# EasyEDA Pro project ProPrj_Microros_esp32_2025-06-17.epro, board PCB1
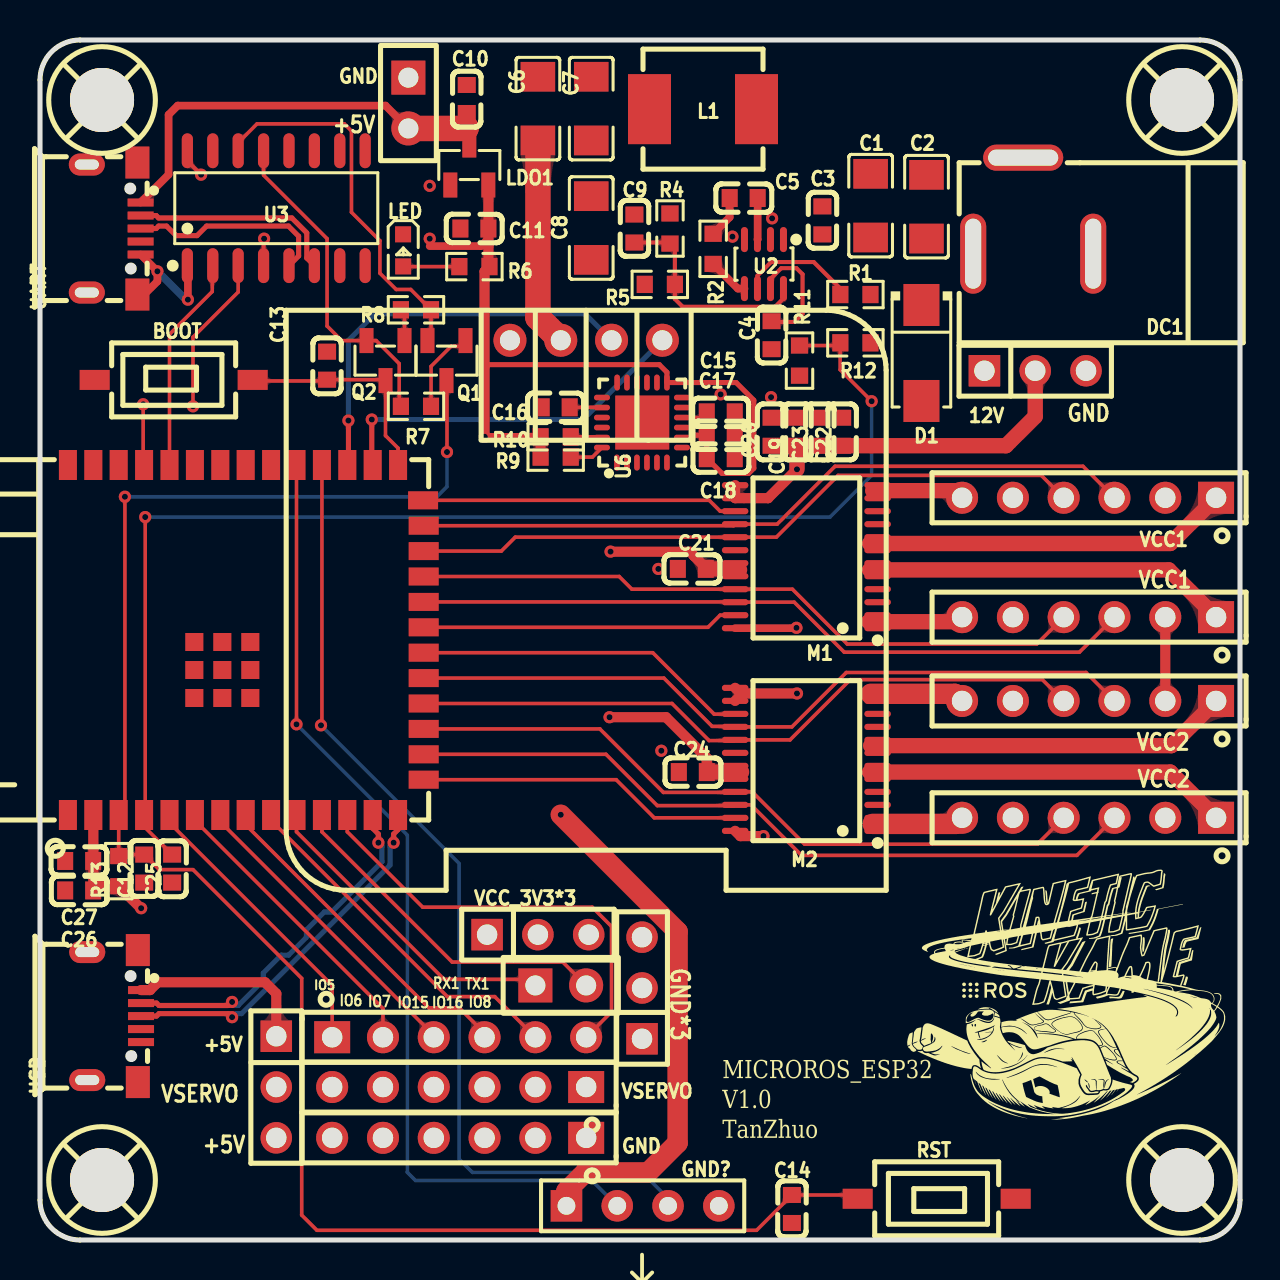
[diagram p8: board, top side]
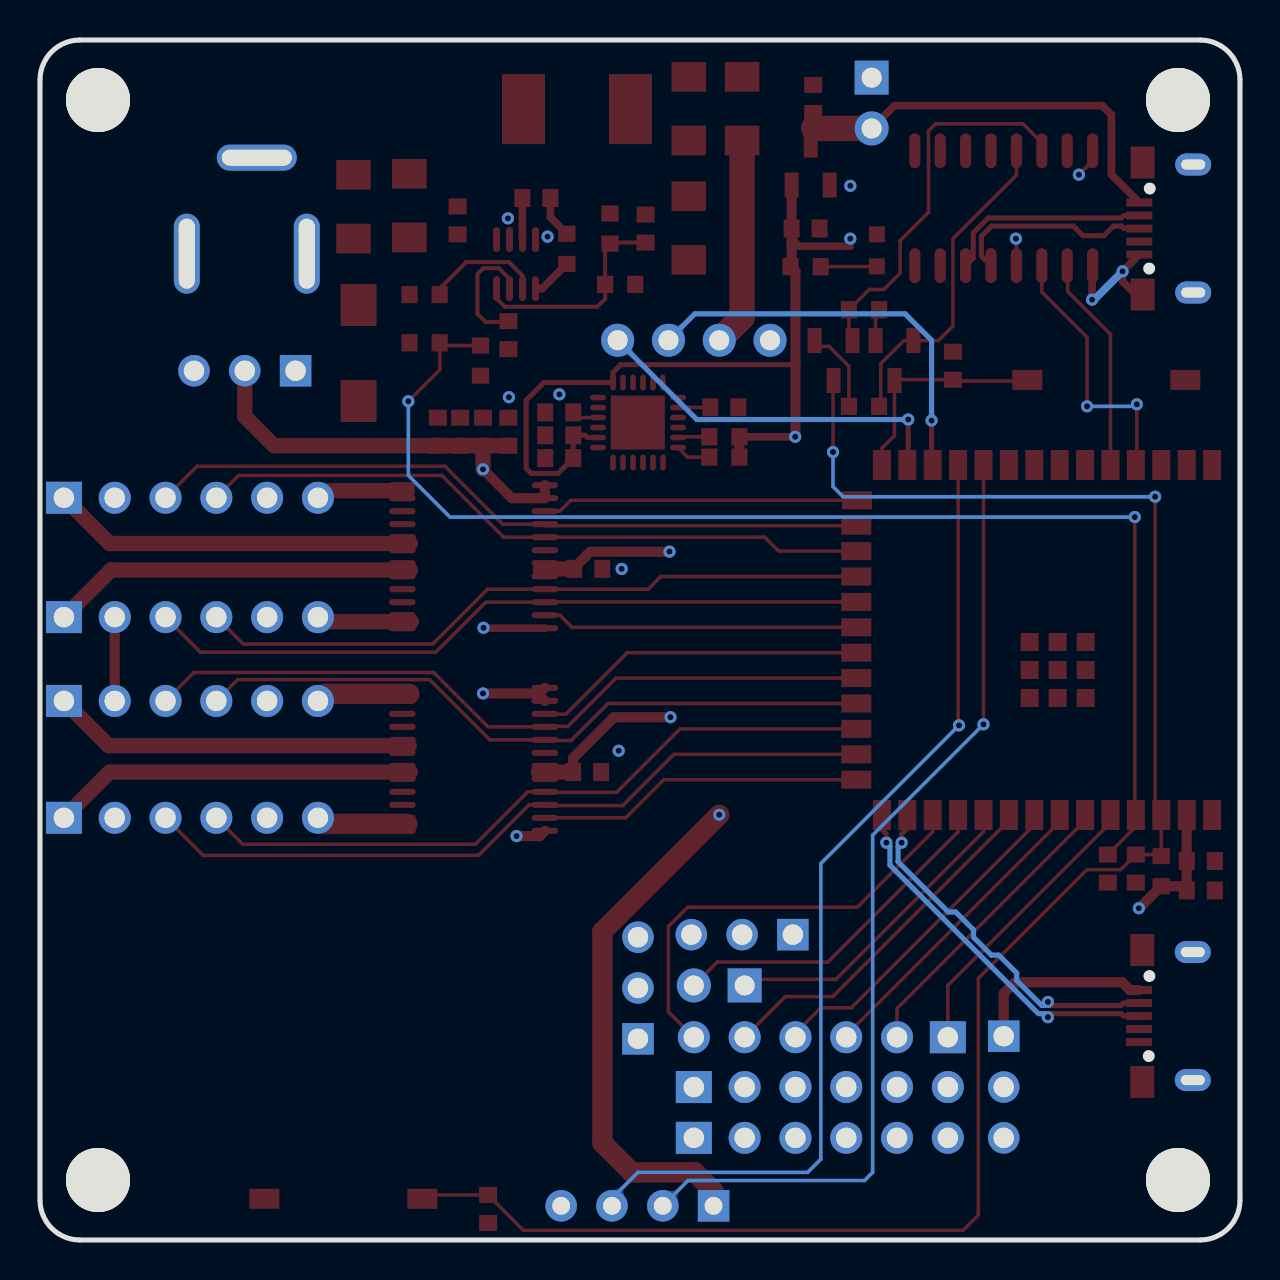
[diagram p9: board, bottom side, seen from below]

Outline 60 x 60 mm; copper layers: Top Layer, GND, POWER, Bottom Layer. Coordinates in mm from the lower left corner of the outline.
Outline path: 0,58 0,2 arc(0.59,0.59) 2,0 58,0 arc(59.41,0.59) 60,2 60,58 arc(59.41,59.41) 58,60 2,60 arc(0.59,59.41) 0,58
Stack: Top Layer 0.035mm 外层铜厚1oz / Dielectric1 0.2104mm 7628 RC49% 8.6mil / GND 0.0152mm 内层铜厚 / Dielectric2 1.065mm 1.1mm H/HOZ 含铜 / POWER 0.0152mm 内层铜厚 / Dielectric3 0.2104mm 7628 RC49% 8.6mil / Bottom Layer 0.035mm 外层铜厚1oz

## Design rules (mm)
net USB_DP: DP1
net USB_DN: DP1
net GPIO_19: DP2
net GPIO_20: DP2
template: 自定义配置
spacing copperThickness1oz (default): track to track 0.102, other pairs 0 to 0.3
spacing copperThickness2oz: track to track 0.203, other pairs 0.152 to 0.3
track width copperThickness1oz (default): min 0.127, default 0.178, max 2.54
track width copperThickness2oz: min 0.203, default 0.254, max 2.54
differential pair differentialPair (default): width min 0.254, default 0.254, max 0.254; gap min 0.152, default 0.152
via viaSize (default): diameter min 0.254, default 0.457, max 10; hole min 0.3, default 0.305, max 6.299
['net', 'gnd'] ['NET', '+12V'] uses innerPlane
['net', 'gnd'] ['NET', 'VCC_3V3'] uses innerPlane
['net', 'gnd'] ['NET', '+5V'] uses innerPlane
['net', 'gnd'] ['NET', 'VMOTOR'] uses innerPlane
['net', 'gnd'] ['NET', 'VSERVO'] uses innerPlane

## Placement (name value [footprint] x y rotation side)
12V  -  [HDR-TH_3P-P2.54-V-F]  49.76 43.46 0 top
+5V  -  [HDR-TH_3P-P2.54-V-F]  11.81 7.65 270 top
BOOT  -  [Key_SMD_3.6x6.1x2.5]  6.68 43 0 top
C1  0.1uf  [C1206]  41.53 51.72 270 top
C2  22uf  [C1206]  44.33 51.67 270 top
C3  33PF  [C0603]  39.12 50.98 270 top
C4  0.1uf  [C0603]  36.58 45.24 270 top
C5  0.1uf  [C0603]  35.18 52.1 180 top
C6  22uf  [C1206]  24.89 56.57 90 top
C7  22uf  [C1206]  27.56 56.57 90 top
C8  22uf  [C1206]  27.56 50.6 270 top
C9  220pf  [C0603]  29.72 50.57 270 top
C10  1uf  [C0603]  21.34 57.05 90 top
C11  1uf  [C0603]  21.72 50.57 0 top
C12  1uf  [C0603]  5.21 18.57 270 top
C13  0.1uf  [C0603]  14.35 43.72 90 top
C14  0.1uf  [C0603]  37.59 1.55 270 top
C15  0.1uf  [C0603]  34.04 41.38 0 top
C16  2.2uf  [C0603]  25.78 41.63 0 top
C17  10nf  [C0603]  34.04 40.24 180 top
C18  0.1uf  [C0603]  34.04 39.09 180 top
C19  10uf  [C0603]  37.85 40.41 90 top
C20  0.1uf  [C0603]  36.58 40.41 90 top
C21  0.1uf  [C0603]  32.59 33.56 180 top
C22  10uf  [C0603]  40.11 40.41 90 top
C23  0.1uf  [C0603]  38.99 40.41 90 top
C24  0.1uf  [C0603]  32.64 23.4 180 top
C25  0.1uf  [C0603]  6.61 18.57 90 top
C26  22uF  [C0603]  1.96 17.48 180 top
C27  100nF  [C0603]  1.96 18.95 0 top
D1  SMAJ12A  [SMA_L4.3-W2.8-LS5.1-RD]  44.07 44.35 270 top
DC1  -  [DC-2.0]  49.79 49.05 0 top
GND  -  [HDR-TH_2P-P2.54-V-F]  18.42 56.85 270 top
GND#2  -  [HDR-TH_6P-P2.54-V-F]  20.96 5.11 180 top
GND👇  -  [HC-SR04]  30.1 1.68 0 top
H2  -  [HDR-TH_6P-P2.54-V-F]  52.45 31.14 180 top
H4  -  [HDR-TH_6P-P2.54-V-F]  52.45 21.11 180 top
H5  -  [HDR-TH_6P-P2.54-V-F]  52.45 26.95 180 top
H14  -  [HDR-TH_3P-P2.54-V-F]  30.1 12.6 90 top
H16  -  [HDR-TH_2P-P2.54-V-F]  26.04 12.73 0 top
IO5  -  [HDR-TH_6P-P2.54-V-F]  20.96 10.14 0 top
L1  4.7uH  [IND-SMD_L6.5-W6.0_GPSR0630]  33.15 56.54 180 top
LDO1  SC662K-3.3V  [SOT-23-3_L2.9-W1.3-P1.90-LS2.4-BR]  21.47 53.75 270 top
LED  -  [LED_0603]  18.16 49.43 270 top
M1  TB6612FNG,C,8,EL  [SSOP-24_L8.3-W5.6-P0.65-LS7.6-BL]  38.32 34.17 90 top
M2  TB6612FNG,C,8,EL  [SSOP-24_L8.3-W5.6-P0.65-LS7.6-BL]  38.32 24.03 90 top
OLED1  0.96OLED_4P_MODULE_JX  [0.96OLED_4P]  27.31 44.99 0 top
Q1  L8050QLT1G  [SOT-23-3_L2.9-W1.3-P1.90-LS2.4-BR]  20.32 43.97 90 top
Q2  L8050QLT1G  [SOT-23-3_L2.9-W1.3-P1.90-LS2.4-BR]  17.27 43.97 90 top
R1  -  [R0603]  40.77 47.27 180 top
R2  -  [R0603]  33.66 49.56 90 top
R4  -  [R0603]  31.5 50.57 90 top
R5  -  [R0603]  30.99 47.78 0 top
R6  -  [R0603]  21.72 48.67 180 top
R7  -  [R0603]  18.8 41.68 0 top
R8  -  [R0603]  18.8 46.51 180 top
R9  -  [R0603]  25.78 39.14 180 top
R10  -  [R0603]  25.78 40.16 180 top
R11  -  [R0603]  37.98 43.97 90 top
R12  -  [R0603]  40.77 44.86 0 top
R13  10kΩ  [R0603]  3.94 18.44 270 top
RST  -  [Key_SMD_3.6x6.1x2.5]  44.83 2.06 180 top
TP1  -  [M3螺丝]  3.17 56.94 0 top
TP2  -  [M3螺丝]  57.17 56.94 0 top
TP3  -  [M3螺丝]  57.17 2.94 0 top
TP4  -  [M3螺丝]  3.17 2.94 0 top
U1  ESP32-S3-WROOM-1-N16R2  [WIRELM-SMD_ESP32-S3-WROOM-1]  10.29 30 90 top
U2  -  [SOT-23-8_L2.9-W1.6-P0.65-LS2.8-BR]  36.2 48.8 90 top
U3  CH340C  [SOP-16_L10.0-W3.9-P1.27-LS6.0-BL]  11.81 51.59 0 top
U6  MPU-6050  [QFN-24_L4.0-W4.0-P0.50-BL-EP2.7]  30.1 40.87 0 top
UART  MicroUSB-5PIN  [USB-SMD_5P_MICROUSB-5PIN]  3.69 50.57 270 top
USB  MicroUSB-5PIN  [USB-SMD_5P_MICROUSB-5PIN]  3.71 11.2 270 top
VCC1  -  [HDR-TH_6P-P2.54-V-F]  52.45 37.11 180 top
VCC_3V3*3  -  [HDR-TH_3P-P2.54-V-F]  24.89 15.27 0 top
VSERVO  -  [HDR-TH_6P-P2.54-V-F]  20.96 7.65 180 top

## Footprints (pads in the part's own frame, mm; a bottom-side part is the same pattern mirrored in y, then rotated)
0.96OLED_4P
  round 1.65 hole 1: 1(-3.81,-0.002) 2(-1.27,0.002) 3(1.27,0.002) 4(3.81,0.002)
C0603
  rect 0.8x0.9 smd: 1(-0.7,0) 2(0.7,0)
C1206
  rect 1.485x1.728 smd: 1(-1.593,0) 2(1.593,0)
DC-2.0
  oval 4x1.3 hole 3.5x0.8: 2(-0.627,5.067)
  oval 1.3x4 hole 0.8x3.5: 3(2.873,0.267) 4(-3.127,0.267)
HC-SR04
  rect 1.575x1.575 hole 0.889: 1(-3.78,0.03)
  round 1.575 hole 0.889: 2(-1.24,0.03) 3(1.3,0.03) 4(3.84,0.03)
HDR-TH_2P-P2.54-V-F
  rect 1.7x1.7 hole 1: 1(-1.27,0)
  round 1.7 hole 1: 2(1.27,0)
HDR-TH_3P-P2.54-V-F
  rect 1.575x1.575 hole 1.02: 1(-2.54,0)
  round 1.575 hole 1.02: 2(0,0) 3(2.54,0)
HDR-TH_6P-P2.54-V-F
  rect 1.8x1.6 hole 1.02: 1(-6.35,0)
  round 1.6 hole 1.02: 2(-3.81,0) 3(-1.27,0) 4(1.27,0) 5(3.81,0) 6(6.35,0)
IND-SMD_L6.5-W6.0_GPSR0630
  rect 2.15x3.5 smd: 1(-2.675,0) 2(2.675,0)
Key_SMD_3.6x6.1x2.5
  rect 1.501x1.001 smd: 1(-3.95,0) 2(3.95,0)
LED_0603
  rect 0.8x0.8 smd: 1(-0.851,-0.01) 2(0.75,-0.005)
M3螺丝
  round 3.2 hole 3.2: 1(-0.064,0.064)
QFN-24_L4.0-W4.0-P0.50-BL-EP2.7
  oval 0.28x0.8 smd: 1(-1.25,-2) 2(-0.75,-2) 3(-0.25,-2) 4(0.25,-2) 5(0.75,-2) 6(1.25,-2) 13(1.25,2) 14(0.75,2) 15(0.25,2) 16(-0.25,2) 17(-0.75,2) 18(-1.242,2)
  oval 0.8x0.28 smd: 7(2,-1.25) 8(2,-0.75) 9(2,-0.25) 10(2,0.25) 11(2,0.75) 12(2,1.25) 19(-2,1.25) 20(-2,0.75) 21(-2,0.25) 22(-2,-0.25) 23(-2,-0.75) 24(-2,-1.25)
  rect 2.7x2.7 smd: 25(0.013,0)
R0603
  rect 0.806x0.864 smd: 1(-0.753,0) 2(0.753,0)
SMA_L4.3-W2.8-LS5.1-RD
  rect 2.1x1.8 smd: 1(-2.4,0) 2(2.4,0)
SOP-16_L10.0-W3.9-P1.27-LS6.0-BL
  oval 0.56x1.745 smd: 1(-4.445,-2.873) 2(-3.175,-2.873) 3(-1.905,-2.873) 4(-0.635,-2.873) 5(0.635,-2.873) 6(1.905,-2.873) 7(3.175,-2.873) 8(4.445,-2.873) 9(4.445,2.873) 10(3.175,2.873) 11(1.905,2.873) 12(0.635,2.873) 13(-0.635,2.873) 14(-1.905,2.873) 15(-3.175,2.873) 16(-4.445,2.873)
SOT-23-3_L2.9-W1.3-P1.90-LS2.4-BR
  rect 1.25x0.7 smd: 1(1,-0.95) 2(1,0.95) 3(-1,0)
SOT-23-8_L2.9-W1.6-P0.65-LS2.8-BR
  oval 1.252x0.35 smd: 1(1.226,-0.975) 2(1.226,-0.325) 3(1.226,0.325) 4(1.226,0.975) 5(-1.226,0.975) 6(-1.226,0.325) 7(-1.226,-0.325) 8(-1.226,-0.975)
SSOP-24_L8.3-W5.6-P0.65-LS7.6-BL
  oval 0.308x1.324 smd: 1(-3.575,-3.562) 2(-2.925,-3.562) 3(-2.275,-3.562) 4(-1.625,-3.562) 5(-0.975,-3.562) 6(-0.325,-3.562) 7(0.325,-3.562) 8(0.975,-3.562) 9(1.625,-3.562) 10(2.275,-3.562) 11(2.925,-3.562) 12(3.575,-3.562) 13(3.575,3.562) 14(2.925,3.562) 15(2.275,3.562) 16(1.625,3.562) 17(0.975,3.562) 18(0.325,3.562) 19(-0.325,3.562) 20(-0.975,3.562) 21(-1.625,3.562) 22(-2.275,3.562) 23(-2.925,3.562) 24(-3.575,3.562)
USB-SMD_5P_MICROUSB-5PIN
  rect 0.4x1.3 smd: 1(-1.3,1.345) 2(-0.65,1.345) 3(0,1.345) 4(0.65,1.345) 5(1.3,1.345)
  rect 1.6x1.2 smd: 6(3.3,1.185) 7(-3.3,1.185)
  oval 1.1x1.8 hole 0.5x1.2: 8(3.2,-1.345) 9(-3.2,-1.345)
WIRELM-SMD_ESP32-S3-WROOM-1
  rect 1.5x0.9 smd: 1(-8.75,8.895) 2(-8.75,7.625) 3(-8.75,6.355) 4(-8.75,5.085) 5(-8.75,3.815) 6(-8.75,2.545) 7(-8.75,1.275) 8(-8.75,0.005) 9(-8.75,-1.265) 10(-8.75,-2.535) 11(-8.75,-3.805) 12(-8.75,-5.075) 13(-8.75,-6.345) 14(-8.75,-7.615) 27(8.75,-7.615) 28(8.75,-6.345) 29(8.75,-5.075) 30(8.75,-3.805) 31(8.75,-2.535) 32(8.75,-1.265) 33(8.75,0.005) 34(8.75,1.275) 35(8.75,2.545) 36(8.75,3.815) 37(8.75,5.085) 38(8.75,6.355) 39(8.75,7.625) 40(8.75,8.895)
  rect 0.9x1.5 smd: 15(-6.985,-8.895) 16(-5.715,-8.895) 17(-4.445,-8.895) 18(-3.175,-8.895) 19(-1.905,-8.895) 20(-0.635,-8.895) 21(0.635,-8.895) 22(1.905,-8.895) 23(3.175,-8.895) 24(4.445,-8.895) 25(5.715,-8.895) 26(6.985,-8.865)
  rect 0.9x0.9 smd: 41(-2.9,2.575) 41(-2.9,1.175) 41(-2.9,-0.225) 41(-1.5,2.575) 41(-1.5,1.175) 41(-1.5,-0.225) 41(-0.1,2.575) 41(-0.1,1.175) 41(-0.1,-0.225)

## Nets
+5V: +5V.1 +5V.3 C6.1 C7.1 C8.1 C9.1 C10.1 C21.1 C24.1 GND.2 GND👇.1 L1.2 LDO1.3 M1.19 M1.20 M2.19 M2.20 OLED1.2 R4.2 UART.1 USB.1
+12V: 12V.1 C1.2 C2.2 C3.2 D1.1 DC1.4 R1.1 R12.2 U2.1
GND: 12V.3 BOOT.1 C1.1 C2.1 C3.1 C4.2 C6.2 C7.2 C8.2 C10.2 C11.1 C12.2 C13.2 C14.2 C15.2 C16.1 C17.1 C18.1 C19.2 C20.2 C21.2 C22.2 C23.2 C24.2 C25.1 C26.2 C27.1 D1.2 DC1.2 DC1.3 GND.1 GND#2.1 GND#2.2 GND#2.3 GND#2.4 GND#2.5 GND#2.6 GND👇.4 H2.5 H4.5 H5.5 H14.1 H14.2 H14.3 LDO1.1 LED.1 M1.3 M1.4 M1.9 M1.10 M1.18 M2.3 M2.4 M2.9 M2.10 M2.18 OLED1.1 R5.1 R11.1 RST.1 U1.1 U1.40 U1.41 U2.2 U2.4 U3.1 U6.1 U6.9 U6.11 U6.18 U6.25 UART.5 UART.6 UART.7 UART.8 UART.9 USB.5 USB.6 USB.7 USB.8 USB.9 VCC1.5
VCC_3V3: C11.2 C17.2 C18.2 C26.1 C27.2 H2.2 H4.2 H5.2 LDO1.2 R6.1 R9.2 R10.2 R13.2 U1.2 U3.4 U3.16 U6.8 U6.13 VCC1.2 VCC_3V3*3.1 VCC_3V3*3.2 VCC_3V3*3.3
ADC: C25.2 R11.2 R12.1 U1.4
DTR: Q2.2 R7.1 U3.13
ECHO: GND👇.3 U1.30
ESP_RST: C12.1 C14.1 Q1.3 R13.1 RST.2 U1.3
ESP_RX: U1.36 U3.2
ESP_TX: U1.37 U3.3
GPIO_0: BOOT.2 C13.1 Q2.3 U1.27
GPIO_3: M2.23 U1.15
GPIO_5: IO5.1 U1.5
GPIO_6: IO5.2 U1.6
GPIO_7: IO5.3 U1.7
GPIO_8: IO5.6 U1.12
GPIO_9: H4.4 M2.21 U1.17
GPIO_10: H5.4 M2.17 U1.18
GPIO_11: H5.3 M2.16 U1.19
GPIO_12: M2.15 U1.20
GPIO_13: M1.23 U1.21
GPIO_14: H2.3 M1.22 U1.22
GPIO_15: IO5.4 U1.8
GPIO_16: IO5.5 U1.9
GPIO_19: U1.13 USB.2
GPIO_20: U1.14 USB.3
GPIO_21: H2.4 M1.21 U1.23
GPIO_35: OLED1.4 U1.28
GPIO_36: OLED1.3 U1.29
GPIO_38: GND👇.2 U1.31
GPIO_45: M1.15 U1.26
GPIO_46: H4.3 M2.22 U1.16
GPIO_47: M1.17 U1.24 VCC1.4
GPIO_48: M1.16 U1.25 VCC1.3
M1_AO1: H2.6 M1.1 M1.2
M1_AO2: H2.1 M1.5 M1.6
M1_BO1: M1.11 M1.12 VCC1.6
M1_BO2: M1.7 M1.8 VCC1.1
M2_AO1: H4.6 M2.1 M2.2
M2_AO2: H4.1 M2.5 M2.6
M2_BO1: H5.6 M2.11 M2.12
M2_BO2: H5.1 M2.7 M2.8
RTS: Q1.2 R8.1 U3.14
RX1: H16.1 U1.10
TX1: H16.2 U1.11
USB_DN: U3.6 UART.2
USB_DP: U3.5 UART.3
VMOTOR: 12V.2 C19.1 C20.1 C22.1 C23.1 M1.13 M1.14 M1.24 M2.13 M2.14 M2.24
VSERVO: +5V.2 VSERVO.1 VSERVO.2 VSERVO.3 VSERVO.4 VSERVO.5 VSERVO.6
$1N1219: R1.2 U2.6
$1N1281: C4.1 U2.7
$1N1450: R2.1 U2.5
$1N1453: C5.2 R2.2
$1N1529: C5.1 L1.1 U2.3
$1N1977: C9.2 R4.1 R5.2 U2.8
$1N3291: LED.2 R6.2
$1N4457: Q1.1 R7.2
$1N4475: Q2.1 R8.2
$1N5943: C15.1 U6.10
$1N6016: C16.2 U6.20
$1N6187: R10.1 U6.23
$1N6190: R9.1 U6.24

Pads without a net: TP1 1; TP2 1; TP3 1; TP4 1; U1 32 33 34 35 38 39; U3 7 8 9 10 11 12 15; U6 2 3 4 5 6 7 12 14 15 16 17 19 21 22; UART 4; USB 4

## Via types
v1: diameter 0.61, hole 0.305, Top Layer to Bottom Layer, 35 vias

## Routing (per net, layer and track width the routed paths; a pad name or vN(x,y) marks a point on that pad's centre or on a via; arc(x,y) is an arc through that point)
+5V: length 126
  Top Layer w0.381: GND.2 17.27,56.72 6.89,56.72 6.43,56.26 6.43,53.27 UART.1
  Top Layer w0.508: v1(28.53,34.42) 28.53,34.41 32.5,34.41 32.7,34.21 32.7,34.2 33.34,33.56 ; v1(28.48,26.14) 31.3,26.14 33.34,24.1 C24.1 ; 5.05,12.5 5.5,12.5 5.89,12.89 11.25,12.89 11.81,12.32 +5V.1
  Top Layer w0.762: 34.98,33.5 34.93,33.56 33.34,33.56 ; C24.1 35.08,23.4
  Top Layer w1.016: v1(26.04,21.26) 31.88,15.42 31.88,4.85 30.41,3.38 27.26,3.38 26.32,2.45 GND👇.1
  Top Layer w1.27: C6.1 24.89,46.13 OLED1.2 ; 21.31,55.6 21.29,55.58 GND.2
  POWER w0.508: +5V.3 15.21,1.71 GND👇.1 ; v1(28.48,26.14) 26.05,26.14 26.04,26.15 ; v1(28.53,34.42) 26.12,34.42 26.04,34.34
  POWER w1.27: OLED1.2 v1(26.04,21.26)
GND: length 6.8
  Top Layer w0.381: UART.5 v1(5.87,48.43) 5.87,47.93 5.21,47.27 UART.6 ; v1(7.39,47.02) 7.39,48.69 U3.1
  Bottom Layer w0.381: v1(7.39,47.02) 7.29,47.02 v1(5.87,48.43)
  vias: v1(19.48,52.71) v1(30.92,33.55) v1(31.07,24.46) v1(34.03,42.28) v1(34.62,50.17) v1(36.6,51.08) v1(36.55,42.14)
VCC_3V3: length 164.9
  Top Layer w0.203: v1(11.2,50.07) 11.18,50.04 U3.4 ; v1(8.05,53.27) 7.37,53.95 U3.16
  Top Layer w0.254: 22.23,43.7 22.29,43.77 30.96,43.77 31.35,43.38 U6.13 34.81,42.87 35.69,41.99 35.69,38.58 35.44,38.33 34.1,38.33 33.34,39.09 33.34,40.24 32.74,40.24 32.62,40.12 U6.8
  Top Layer w0.381: R10.2 v1(22.24,40.16) ; 19.48,49.69 22.05,49.69 22.42,50.07
  Top Layer w0.508: v1(5.06,16.59) 5.04,16.59 R13.2 2.67,17.69 ; 2.67,17.69 2.66,17.68 ; 2.67,17.69 2.67,18.94 C27.2 2.66,18.96 2.66,21.25 ; LDO1.2 22.42,52.75 C11.2 22.42,48.72 R6.1 22.23,48.42 22.23,40.17 v1(22.24,40.16) ; R9.2 R10.2 ; H5.2 H2.2
  POWER w0.203: v1(11.2,50.07) 8.05,53.22 v1(8.05,53.27)
  POWER w0.381: v1(11.2,50.07) v1(19.48,50.07)
  POWER w0.508: 22.24,17.76 v1(22.24,40.16) ; 22.24,17.76 54.39,17.76 56.26,19.64 H4.2 H5.2 ; 22.24,17.76 22.24,15.38 VCC_3V3*3.1 ; VCC_3V3*3.1 VCC_3V3*3.2 VCC_3V3*3.3 ; VCC_3V3*3.1 6.38,15.27 v1(5.06,16.59) ; VCC1.2 H2.2
ADC: length 64
  Top Layer w0.178: 40.01,44.85 39.88,44.72 R11.2 ; 40.01,44.85 R12.1 ; 40.01,44.85 40.01,43.51 v1(41.58,41.94) ; C25.2 5.2,20.67 U1.4 5.26,21.31 v1(5.26,36.15)
  Bottom Layer w0.178: v1(5.26,36.15) 39.5,36.15 41.58,38.23 v1(41.58,41.94)
DTR: length 16.6
  Top Layer w0.178: R7.1 17.96,41.77 17.96,43.82 16.81,44.97 Q2.2 15.08,44.97 14.35,45.7 14.35,50.07 11.18,53.24 U3.13
ECHO: length 49.2
  Top Layer w0.178: U1.30 14.09,25.78 v1(14.05,25.73)
  Bottom Layer w0.178: GND👇.3 31.4,2.08 30.1,3.38 21.62,3.38 20.96,4.04 20.96,18.82 v1(14.05,25.73)
ESP_RST: length 92.2
  Top Layer w0.178: RST.2 40.69,2.25 C14.1 35.83,0.49 13.85,0.49 13.08,1.25 13.08,13.08 7.65,18.52 5.96,18.52 C12.1 4.01,19.27 R13.1 3.93,19.2 U1.3 4.24,21.56 v1(4.24,37.16) ; Q1.3 20.35,42.94 v1(20.35,39.4)
  Bottom Layer w0.178: v1(4.24,37.16) 19.84,37.16 20.35,37.67 v1(20.35,39.4)
ESP_RX: length 10.9
  Top Layer w0.178: U3.2 8.61,48.69 8.61,47.42 6.47,45.29 U1.36
ESP_TX: length 13.6
  Top Layer w0.178: U1.37 5.16,38.8 v1(5.16,41.79) ; U3.3 9.91,47.4 7.65,45.14 v1(7.65,41.68)
  Bottom Layer w0.178: v1(5.16,41.79) 5.26,41.68 v1(7.65,41.68)
GPIO_0: length 11.1
  Top Layer w0.178: U1.27 17.9,39.59 17.27,40.22 Q2.3 17.23,43.02 C13.1 14.29,42.95 10.68,42.95
GPIO_3: length 16.4
  Top Layer w0.178: U1.15 28.81,23.02 30.71,21.11 34.75,21.11 M2.23
GPIO_5: length 14.4
  Top Layer w0.178: 14.61,10.19 14.61,12.73 6.47,20.86 U1.5
GPIO_6: length 15
  Top Layer w0.178: 17.15,10.19 17.15,11.58 7.74,20.98 7.74,21.25
GPIO_7: length 15.5
  Top Layer w0.178: 9.01,21.25 9.01,20.91 19.69,10.24 IO5.3
GPIO_8: length 22.1
  Top Layer w0.178: IO5.6 28.58,11.41 28.58,15.67 27.61,16.64 19.14,16.64 15.36,20.41 15.36,21.25
GPIO_9: length 35
  Top Layer w0.178: H4.4 49.86,19.79 38.23,19.79 35.61,22.41 M2.21 34.73,22.38 31.17,22.38 27.99,25.56 U1.17
GPIO_10: length 34.5
  Top Layer w0.178: U1.18 31.6,26.83 33.45,24.97 34.72,24.97 M2.17 37.5,25.01 40.52,28.02 50.12,28.02 H5.4
GPIO_11: length 37.3
  Top Layer w0.178: U1.19 31.19,28.09 33.61,25.68 34.73,25.68 M2.16 37.59,25.66 40.31,28.37 52.3,28.37 H5.3
GPIO_12: length 16.9
  Top Layer w0.178: U1.20 30.64,29.36 33.71,26.29 34.74,26.29 M2.15
GPIO_13: length 15.8
  Top Layer w0.178: U1.21 33.4,30.64 34.01,31.24 M1.23
GPIO_14: length 36.3
  Top Layer w0.178: H2.3 51.97,29.39 40.21,29.39 37.71,31.89 34.76,31.89 34.74,31.91 U1.22
GPIO_15: length 17
  Top Layer w0.178: IO5.4 22.23,10.34 20.96,11.61 19.43,11.61 10.28,20.76 U1.8
GPIO_16: length 18
  Top Layer w0.178: U1.9 11.55,20.98 20.36,12.17 22.74,12.17 IO5.5
GPIO_19: length 18.2
  Top Layer w0.254: v1(9.6,11.9) 9.43,11.72 5.95,11.72 5.83,11.85 5.05,11.85 ; v1(16.92,19.87) 16.92,20.3 16.63,20.58 U1.13
  Bottom Layer w0.254: v1(9.6,11.9) 9.78,11.72 9.91,11.72 11.17,12.98 11.17,13.35 12.06,14.24 12.43,14.24 13.32,15.14 13.32,15.51 14.21,16.4 14.58,16.4 17.1,18.91 17.1,19.69 v1(16.92,19.87)
GPIO_20: length 18.4
  Top Layer w0.254: v1(17.68,19.87) 17.68,20.3 17.9,20.52 U1.14 ; 5.05,11.2 5.83,11.2 5.95,11.32 9.43,11.32 v1(9.6,11.14)
  Bottom Layer w0.254: v1(17.68,19.87) 17.5,19.69 17.5,18.74 10.08,11.32 9.78,11.32 v1(9.6,11.14)
GPIO_21: length 34
  Top Layer w0.178: U1.23 28.96,33.17 29.59,32.54 34.76,32.54 ; H2.4 49.84,29.8 40.36,29.8 37.62,32.54 M1.21
GPIO_35: length 18.5
  Top Layer w0.254: v1(16.59,41.02) 16.59,38.8 U1.28
  Bottom Layer w0.254: v1(16.59,41.02) 27.15,41.02 OLED1.4
GPIO_36: length 20.5
  Top Layer w0.254: v1(15.42,40.97) 15.42,38.81 15.36,38.75
  Bottom Layer w0.254: v1(15.42,40.97) 15.42,44.99 16.74,46.31 27.26,46.31 OLED1.3
GPIO_38: length 48.9
  Top Layer w0.178: 12.82,38.75 v1(12.82,25.78)
  Bottom Layer w0.178: v1(12.82,25.78) 18.37,20.24 18.37,3.38 18.77,2.97 27.6,2.97 GND👇.2
GPIO_45: length 15.8
  Top Layer w0.178: 34.76,36.44 34.01,36.44 33.46,36.98 U1.26
GPIO_46: length 37.4
  Top Layer w0.178: U1.16 28.3,24.28 30.86,21.72 34.72,21.72 M2.22 35.55,21.76 38.08,19.23 51.84,19.23 H4.3
GPIO_47: length 34
  Top Layer w0.178: U1.24 23.07,34.44 23.76,35.14 36.82,35.14 39.91,38.23 50.07,38.23 VCC1.4
GPIO_48: length 36.4
  Top Layer w0.178: VCC1.3 52.15,38.69 39.75,38.69 36.86,35.79 M1.16 34.68,35.72 U1.25
M1_AO1: length 4.8
  Top Layer w0.762: 41.43,30.91 45.88,30.91 H2.6
M1_AO2: length 18.3
  Top Layer w0.762: H2.1 56.44,33.5 41.48,33.5
M1_BO1: length 4.6
  Top Layer w0.762: VCC1.6 45.75,37.47 41.63,37.47
M1_BO2: length 18.3
  Top Layer w0.762: 41.48,34.83 56.52,34.83 VCC1.1
M2_AO1: length 4.6
  Top Layer w1.016: H4.6 45.8,20.81 41.63,20.81
M2_AO2: length 18.3
  Top Layer w0.762: H4.1 56.52,23.4 41.48,23.4
M2_BO1: length 4.7
  Top Layer w1.016: H5.6 45.75,27.31 41.53,27.31
M2_BO2: length 18.2
  Top Layer w0.762: H5.1 56.57,24.72 41.53,24.72
RTS: length 19.2
  Top Layer w0.178: U3.14 9.91,54.87 10.85,55.81 15.22,55.81 15.57,55.45 15.57,51.39 16.99,49.96 16.99,48.34 17.81,47.53 18.54,47.53 R8.1 19.55,45.15 Q1.2
RX1: length 16
  Top Layer w0.178: H16.1 24.46,13.03 20.2,13.03 12.82,20.41 12.82,21.25
TX1: length 17.2
  Top Layer w0.178: H16.2 26.14,13.9 20.61,13.9 14.09,20.41 U1.11
USB_DN: length 10.5
  Top Layer w0.254: UART.2 5.81,51.22 5.93,51.1 12.59,51.1 13.34,50.36 13.34,49.1 U3.6
USB_DP: length 10.2
  Top Layer w0.254: UART.3 5.81,50.57 5.93,50.7 6.33,50.7 6.8,50.22 7.85,50.22 8.33,50.7 12.42,50.7 12.93,50.19 12.93,49.2 12.45,48.72
VMOTOR: length 49
  Top Layer w0.381: v1(37.82,30.61) 37.8,30.59 M1.24
  Top Layer w0.508: M2.14 35.13,27.33 ; 35.13,27.33 35.04,27.33 M2.13 ; 35.13,27.33 v1(37.85,27.33) ; 34.76,37.74 M1.14 36.41,37.09 v1(37.85,38.53) ; M2.24 35.02,20.2 v1(36.17,20.2)
  Top Layer w0.762: 12V.2 49.76,41.18 48.3,39.71 C22.1 C23.1 C19.1 ; C19.1 C20.1 ; C19.1 v1(37.85,38.53)
  POWER w0.762: v1(37.85,38.53) 37.82,38.51 v1(37.82,30.61) 37.82,27.35 v1(37.85,27.33) 37.85,21.87 v1(36.17,20.2) 36.15,20.2
VSERVO: length 15.5
  POWER w0.762: +5V.2 VSERVO.6 VSERVO.5 VSERVO.4 VSERVO.3 VSERVO.2 VSERVO.1
$1N1219: length 5.9
  Top Layer w0.203: U2.6 35.87,48.22 36.55,48.9 38.69,48.9 40.02,47.57 R1.2
$1N1281: length 6.2
  Top Layer w0.203: C4.1 36.62,45.9 37.72,45.9 38.13,46.31 38.13,48.29 37.82,48.59 37.06,48.59 36.52,48.05 U2.7
$1N1450: length 2.1
  Top Layer w0.381: U2.5 34.89,47.57 R2.1
$1N1453: length 2.1
  Top Layer w0.381: R2.2 34.48,51.14 C5.2
$1N1529: length 2.1
  Top Layer w0.381: U2.3 35.88,50.03 C5.1
$1N1977: length 10.9
  Top Layer w0.203: U2.8 37.16,47.56 37.16,47.07 36.76,46.66 32.13,46.66 31.74,47.05 R5.2 31.74,49.58 R4.1 31.45,49.87 C9.2
$1N3291: length 2.8
  Top Layer w0.178: R6.2 18.17,48.67 18.16,48.68
$1N4457: length 4.3
  Top Layer w0.178: Q1.1 20.98,44.68 20.55,44.68 19.55,43.68 R7.2
$1N4475: length 1.6
  Top Layer w0.178: R8.2 18.22,46.33 Q2.1
$1N5943: length 1.3
  Top Layer w0.178: U6.10 33.08,41.12 33.34,41.38
$1N6016: length 1.6
  Top Layer w0.178: C16.2 28.09,41.63 28.1,41.62
$1N6187: length 1.6
  Top Layer w0.178: R10.1 28.06,40.16 U6.23
$1N6190: length 1.8
  Top Layer w0.178: 28.1,39.62 27.62,39.14 R9.1

## Copper pours and planes (outline as drawn; the poured copper is in the pictures)
+5V on Top Layer: 17.17,57.05 23.75,57.05 23.75,53.52 17.17,53.52
+5V on Top Layer: 17.14,57.03 17.11,57.05 17.11,53.88 17.19,53.7 17.37,53.62 25.68,53.62 25.86,53.55 25.94,53.37 25.94,50.83 26.01,50.65 26.19,50.57 32.29,50.57 32.47,50.65 32.54,50.83 32.54,58.91 32.49,58.96 28.93,58.96 28.88,58.91 28.88,57.28 28.81,57.1 28.63,57.03
+12V on Top Layer: 45.69,42.57 45.77,42.39 45.95,42.31 48.67,42.31 48.69,42.29 48.69,51.49 48.62,51.67 48.44,51.74 40.11,51.8 40.11,51.79 40.11,51.18 40.03,51 39.86,50.93 37.09,50.93 36.91,50.86 36.84,50.68 36.84,49.27 36.86,49.25 39.85,49.25 40.03,49.18 40.11,49 40.11,48.58 40.18,48.4 40.36,48.32 40.47,48.32 40.65,48.25 40.72,48.07 40.72,43.61 40.79,43.43 40.97,43.36 45.7,43.36 45.69,43.3
GND on Top Layer: -0.23,-0.33 -1.34,-1.44 61.29,-1.44 62.16,-2.31 62.16,62.51 64.14,64.49 -0.23,64.49
GND on Top Layer: 7.26,30.35 11,30.35 11,26.65 7.26,26.65
GND on Top Layer: 50.73,42.17 50.73,52 39.75,52 39.57,51.92 39.5,51.74 39.5,51.44 39.43,51.26 39.25,51.18 38.18,51.18 38.13,51.23 38.13,57.23 38.18,57.28 54.02,57.28 54.12,57.26 54.2,57.2 54.33,57.07 54.39,56.99 54.41,56.89 54.41,42.42 54.34,42.24 54.16,42.17
GND on Top Layer: 17.23,59.74 17.23,57.26 17.15,57.18 28.63,57.18 28.68,57.23 28.68,59.67 28.73,59.72 17.25,59.72
GND on Bottom Layer: -0.18,64.29 -0.18,0.03 -0.94,-0.73 60.78,-0.73 61.24,-1.19 61.24,61.44 63.68,63.88 1.75,63.88 0.64,65 0.54,65
GND on GND: -7.24,67.08 68.76,67.08 68.76,-2.82 -7.24,-2.82
GND on POWER: -6.88,67.08 67.69,67.08 67.69,-2.82 -6.88,-2.82
$1N1529 on Top Layer: 36.17,49.23 36.15,49.2 35.84,49.2 35.66,49.28 35.59,49.46 35.59,51.18 35.21,51.18 35.21,53.52 35.14,53.7 34.96,53.77 33.81,53.77 33.63,53.85 33.56,54.03 33.56,59.29 33.63,59.47 33.81,59.54 37.92,59.54 38.1,59.47 38.18,59.29 38.18,54.03 38.1,53.85 37.92,53.77 36.91,53.77 36.73,53.7 36.65,53.52 36.65,51.18 36.17,51.18

Small or netless copper shapes (teardrops, artwork), in the pictures only: 157 on Top Layer, 14 on Bottom Layer, 33 on POWER

## Text on the board
Top Silkscreen Layer: IO6 | IO7 | IO15 | IO16 | RX1 | TX1 | IO8 | +5V | VSERVO | VCC2 | VCC1 | GND | GND*3 | MICROROS_ESP32 / V1.0 / TanZhuo
